# EAGLE board MOD-EEG-SMT (EAGLE 6.4)
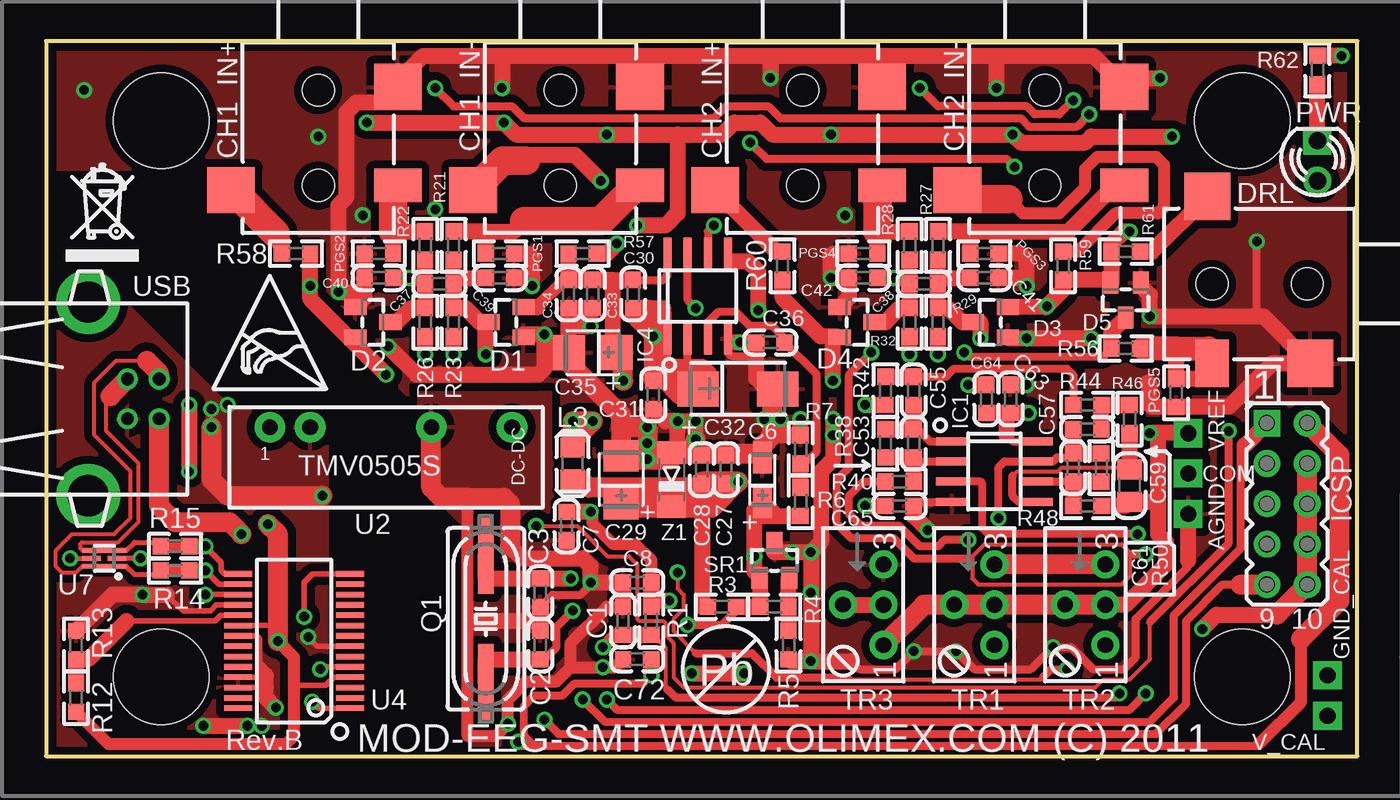
[diagram p1: board, top side]
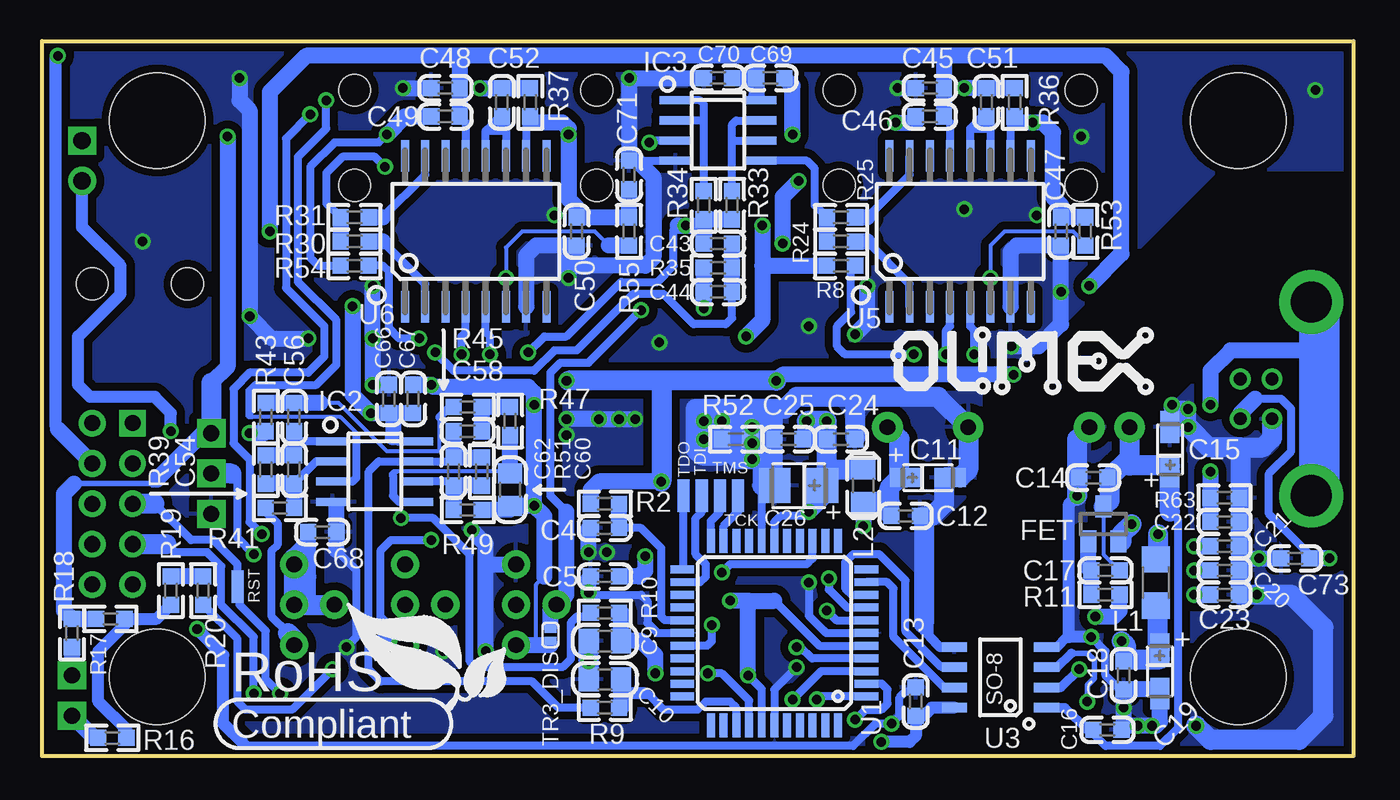
[diagram p2: board, bottom side, seen from below]

Size 82.5 x 45 mm. Coordinates in mm from the lower left corner, seen from the top.
Outline: 0,0 82.5,0 82.5,45 0,45 0,0
Copper layers (1+16): Top 0.035mm / dielectric 1.5mm / Bottom 0.035mm
Design rules "default": minimum track width 10mil, minimum drill 0.5994mm, track to track 10mil, track to pad 10mil, pad to pad 10mil, via to via 10mil, smd to smd 1mil, copper to edge 10mil, drill to drill 10mil, minimum pad ring 10mil, minimum via ring 8mil, stop-mask expansion 4mil, vias tented up to drill 25mil, thermal gap 20mil
Net classes: 1 pwr: width 0.4 mm, clearance 0.23 mm
Holes 6 mm at 7.25,5 75.25,5 7.25,40 75.25,40
tKeepout: area 22.5,43 to 30.5,45; area 21.2,0.2 to 29.2,2.2; area 45.9,0.1 to 61.9,2.1; area 45.3,43 to 61.3,45
bKeepout: area 46.8,43 to 62.8,45; area 22.5,43 to 30.5,45; area 21.2,0.2 to 29.2,2.2; area 47.3,0.2 to 63.3,2.2
tRestrict: 20 lines
bRestrict: 22 lines

## Footprints (pad centres in the part's own frame; a part is rotated, then mirrored left to right if it is on the bottom)
TEST_PAD40/70/SQUARE = drill 1.016 pad 1.778 square: P$1 0,0
C0603_DWS = smd 1.016 x 1.016: 1 -0.889,0; 2 0.889,0
CT3216 = smd 2 x 1.2: + -1.4,0; - 1.4,0
C0805_5MIL_DWS = smd 1.27 x 1.524: 1 -1.016,0; 2 1.016,0
C0603_DWS_NA = smd 1.016 x 1.016: 1 -0.889,0; 2 0.889,0
CT3528 = smd 2 x 2.2: + -1.5,0; - 1.5,0
CT6032 = smd 2.6 x 2.2: + -2.5,0; - 2.5,0
PHONE_JACK-SMD = smd 2.9 x 3: 1 -0.2,5; 5 6.3,-5.5 | smd 2.1 x 3: 2 6,5 | hole 2: 0,0; 6,0
SOT23C(BAT54S) = smd 1 x 1.4: 1 -0.95,-1.1; 2 0.95,-1.1; 3 0,1.1
SOT23 = smd 1 x 1.4: 1 -0.95,-1.1; 2 0.95,-1.1; 3 0,1.1
SO08 = smd 0.508 x 2.032: 1 -1.905,-2.667; 2 -0.635,-2.667; 3 0.635,-2.667; 4 1.905,-2.667; 5 1.905,2.667; 6 0.635,2.667; 7 -0.635,2.667; 8 -1.905,2.667
ML10_NEW = drill 1.016 pad 1.676 square: 1 -5.08,-1.27 | drill 1.016 pad 1.676: 2 -5.08,1.27; 3 -2.54,-1.27; 4 -2.54,1.27; 5 0,-1.27; 6 0,1.27; 7 2.54,-1.27; 8 2.54,1.27; 9 5.08,-1.27; 10 5.08,1.27
L1206_5MIL = smd 1.651 x 1.778: 1 -1.46,0; 2 1.46,0
L0805_5MIL_DWS = smd 1.27 x 1.524: 1 -1.016,0; 2 1.016,0
0603 = smd 1.016 x 1.016: 1 -0.889,0; 2 0.889,0
LED-3.0MM = drill 1.092 pad 1.778: A -1.27,0 | drill 1.092 pad 1.778 square: K 1.27,0
HC49/SMD2_THIN = smd 5 x 1: 1 -4.064,0; 2 4.064,0
R0603_5MIL_DWS = smd 1.016 x 1.016: 1 -0.889,0; 2 0.889,0
R0603_5MIL_DWS_NA = smd 1.016 x 1.016: 1 -0.889,0; 2 0.889,0
0603_0R = smd 1.016 x 1.016: 1 -0.889,0; 2 0.889,0
SMD80/30 = smd 2.032 x 0.762: P$1 0,0
SOT-23 = smd 1 x 1.4: 1 -0.95,-1.1; 2 0.95,-1.1; 3 0,1.1
S64Y = drill 0.991 pad 1.778: 1 2.54,1.27; 2 0,-1.27; 3 -2.54,1.27
SJ_1_SMALLER = smd 0.508 x 0.762: 1 -0.381,0; 2 0.381,0
44TQFP = smd 1.5 x 0.5: 1 -5.8,4; 2 -5.8,3.2; 3 -5.8,2.4; 4 -5.8,1.6; 5 -5.8,0.8; 6 -5.8,0; 7 -5.8,-0.8; 8 -5.8,-1.6; 9 -5.8,-2.4; 10 -5.8,-3.2; 11 -5.8,-4; 23 5.8,-4; 24 5.8,-3.2; 25 5.8,-2.4; 26 5.8,-1.6; 27 5.8,-0.8; 28 5.8,0; 29 5.8,0.8; 30 5.8,1.6; 31 5.8,2.4; 32 5.8,3.2; 33 5.8,4 | smd 0.5 x 1.5: 12 -4,-5.8; 13 -3.2,-5.8; 14 -2.4,-5.8; 15 -1.6,-5.8; 16 -0.8,-5.8; 17 0,-5.8; 18 0.8,-5.8; 19 1.6,-5.8; 20 2.4,-5.8; 21 3.2,-5.8; 22 4,-5.8; 34 4,5.8; 35 3.2,5.8; 36 2.4,5.8; 37 1.6,5.8; 38 0.8,5.8; 39 0,5.8; 40 -0.8,5.8; 41 -1.6,5.8; 42 -2.4,5.8; 43 -3.2,5.8; 44 -4,5.8
TMADCDC = drill 0.991 pad 1.93: 1 1.27,6.35; 2 1.27,3.81; 5 1.27,-3.81; 7 1.27,-8.89
SO-8_ISOLATE = smd 0.6 x 1.6: 1 -1.905,-2.9; 2 -0.635,-2.9; 3 0.635,-2.9; 4 1.905,-2.9; 5 1.905,2.9; 6 0.635,2.9; 7 -0.635,2.9; 8 -1.905,2.9
SSOP28 = smd 0.35 x 1.75: 1 -4.225,-3.525; 2 -3.575,-3.525; 3 -2.925,-3.525; 4 -2.275,-3.525; 5 -1.625,-3.525; 6 -0.975,-3.525; 7 -0.325,-3.525; 8 0.325,-3.525; 9 0.975,-3.525; 10 1.625,-3.525; 11 2.275,-3.525; 12 2.925,-3.525; 13 3.575,-3.525; 14 4.225,-3.525; 15 4.225,3.525; 16 3.575,3.525; 17 2.925,3.525; 18 2.275,3.525; 19 1.625,3.525; 20 0.975,3.525; 21 0.325,3.525; 22 -0.325,3.525; 23 -0.975,3.525; 24 -1.625,3.525; 25 -2.275,3.525; 26 -2.925,3.525; 27 -3.575,3.525; 28 -4.225,3.525
SO16 = smd 0.5 x 2: 1 -4.445,-4.75; 2 -3.175,-4.75; 3 -1.905,-4.75; 4 -0.635,-4.75; 5 0.635,-4.75; 6 1.905,-4.75; 7 3.175,-4.75; 8 4.445,-4.75; 9 4.445,4.75; 10 3.175,4.75; 11 1.905,4.75; 12 0.635,4.75; 13 -0.635,4.75; 14 -1.905,4.75; 15 -3.175,4.75; 16 -4.445,4.75
USBLC6-2P6 = smd 0.3 x 1.46: 1 -0.5,-0.65; 3 0.5,-0.65; 4 0.5,0.65; 6 -0.5,0.65 | smd 0.3 x 1.16: 2 0,-0.8; 5 0,0.8
USB_NEAR_BLACK = drill 0.8: 1 1.25,6.5; 2 -1.25,6.5; 3 -1.25,4.5; 4 1.25,4.5 | drill 2.6 pad 4: P$1 -6.096,2.032; P$2 6.096,2.032
MINI-MELF = smd 1.4 x 1.8: 1 -1.7,0; 2 1.7,0

## Placement (x,y rotation side)
AGND  TESTPAD3  [TEST_PAD40/70/SQUARE]  71.86,15.24 90 top
C1  100nF/X7R/10%  [C0603_DWS]  36.3,8.51 90 top
C2  39pF/COG/5%  [C0603_DWS]  31.09,6.99 90 top
C3  39pF/COG/5%  [C0603_DWS]  31.09,10.29 270 top
C4  10nF/X7R/10%  [C0603_DWS]  47.09,14.35 180 bottom
C5  100nF/X7R/10%  [C0603_DWS]  47.09,11.3 180 bottom
C6  10uF/6.3V/TANT  [CT3216]  45.06,17.4 90 top
C7  100nF/X7R/10%  [C0603_DWS]  32.74,14.48 270 top
C8  100nF/X7R/10%  [C0603_DWS]  37.19,10.92 180 top
C9  220nF/X7R/5%(08053C224JAT2A/1740667)  [C0805_5MIL_DWS]  47.09,7.24 180 bottom
C10  220nF/X7R/5%(08053C224JAT2A/1740667)  [C0805_5MIL_DWS]  47.09,4.83 180 bottom
C11  10uF/6.3V/TANT  [CT3216]  26.77,17.53 0 bottom
C12  100nF/X7R/10%  [C0603_DWS]  28.17,15.11 0 bottom
C13  100nF/X7R/10%  [C0603_DWS]  27.54,3.43 90 bottom
C14  100nF/X7R/10%  [C0603_DWS]  16.36,17.53 180 bottom
C15  10uF/6.3V/TANT  [CT3216]  11.53,19.3 90 bottom
C16  100nF/X7R/10%  [C0603_DWS]  15.47,1.65 0 bottom
C17  100nF/X7R/10%  [C0603_DWS]  15.6,11.68 180 bottom
C18  100nF/X7R/10%  [C0603_DWS]  14.45,5.08 270 bottom
C19  10uF/6.3V/TANT  [CT3216]  12.17,5.33 270 bottom
C20  NA  [C0603_DWS_NA]  8.1,11.68 0 bottom
C21  NA  [C0603_DWS_NA]  8.1,13.21 0 bottom
C22  10nF/X7R/10%  [C0603_DWS]  8.1,14.73 0 bottom
C23  100nF/X7R/10%  [C0603_DWS]  8.1,10.16 0 bottom
C24  10nF/X7R/10%  [C0603_DWS]  32.23,19.94 0 bottom
C25  100nF/X7R/10%  [C0603_DWS]  35.54,19.94 180 bottom
C26  47µF/6.3V/TANT  [CT3528]  34.9,17.02 180 bottom
C27  10nF/X7R/10%  [C0603_DWS]  42.77,18.03 90 top
C28  100nF/X7R/10%  [C0603_DWS]  41.25,18.03 90 top
C29  47µF/6.3V/TANT  [CT3528]  36.17,17.4 90 top
C30  100nF/X7R/10%  [C0603_DWS]  36.93,29.08 90 top
C31  100nF/X7R/10%  [C0603_DWS]  38.2,22.73 270 top
C32  47µF/10%/6.3V/TANT(C)/ESR 0.25 ohm (TR3C476K6R3C0250/1754044)  [CT6032]  43.54,23.11 0 top
C33  10nF/X7R/10%  [C0603_DWS]  34.39,29.08 270 top
C34  100nF/X7R/10%  [C0603_DWS]  32.87,29.08 270 top
C35  47µF/6.3V/TANT  [CT3528]  34.39,25.4 180 top
C36  10nF/X7R/10%  [C0603_DWS]  45.57,26.04 180 top
C37  10nF/X7R/10%  [C0603_DWS]  24.74,29.72 0 top
C38  10nF/X7R/10%  [C0603_DWS]  55.22,29.72 0 top
C39  100pF/COG/5%  [C0603_DWS]  28.55,30.1 180 top
C40  100pF/COG/5%  [C0603_DWS]  20.93,30.1 180 top
C41  100pF/COG/5%  [C0603_DWS]  59.03,30.1 180 top
C42  100pF/COG/5%  [C0603_DWS]  51.41,30.1 180 top
C43  1nF/X7R/10%  [C0603_DWS]  39.98,32.26 0 bottom
C44  1nF/X7R/10%  [C0603_DWS]  39.98,29.21 0 bottom
C45  100nF/X7R/10%  [C0603_DWS]  26.65,42.04 180 bottom
C46  100nF/X7R/10%  [C0603_DWS]  26.65,40.26 180 bottom
C47  100nF/X7R/10%  [C0603_DWS]  18.39,33.02 90 bottom
C48  100nF/X7R/10%  [C0603_DWS]  57.13,42.04 180 bottom
C49  100nF/X7R/10%  [C0603_DWS]  57.13,40.26 180 bottom
C50  100nF/X7R/10%  [C0603_DWS]  48.87,33.02 90 bottom
C51  1uF/X5R/10%  [C0603_DWS]  23.09,41.15 90 bottom
C52  1uF/X5R/10%  [C0603_DWS]  53.57,41.15 90 bottom
C53  1nF/X7R/10%  [C0603_DWS]  54.59,19.68 90 top
C54  1nF/X7R/10%  [C0603_DWS]  66.65,18.03 90 bottom
C55  1uF/X5R/10%  [C0603_DWS]  54.59,22.99 90 top
C56  1uF/X5R/10%  [C0603_DWS]  66.65,21.34 90 bottom
C57  33nF/X7R/5%(06035C333JAT2A/1740618)  [C0603_DWS]  65.51,20.57 180 top
C58  33nF/X7R/5%(06035C333JAT2A/1740618)  [C0603_DWS]  55.73,20.45 180 bottom
C59  220nF/X7R/5%(08053C224JAT2A/1740667)  [C0805_5MIL_DWS]  68.17,17.02 270 top
C60  220nF/X7R/5%(08053C224JAT2A/1740667)  [C0805_5MIL_DWS]  53.06,16.76 270 bottom
C61  1nF/X7R/10%  [C0603_DWS]  64.62,18.16 90 top
C62  1nF/X7R/10%  [C0603_DWS]  56.62,17.91 90 bottom
C63  100nF/X7R/10%  [C0603_DWS]  60.68,22.48 90 top
C64  100nF/X7R/10%  [C0603_DWS]  59.16,22.48 90 top
C65  100nF/X7R/10%  [C0603_DWS]  53.7,15.75 180 top
C66  100nF/X7R/10%  [C0603_DWS]  60.68,22.48 90 bottom
C67  100nF/X7R/10%  [C0603_DWS]  59.16,22.48 90 bottom
C68  100nF/X7R/10%  [C0603_DWS]  64.87,14.1 180 bottom
C69  100nF/X7R/10%  [C0603_DWS]  36.68,42.67 0 bottom
C70  100nF/X7R/10%  [C0603_DWS]  39.98,42.67 180 bottom
C71  100nF/X7R/10%  [C0603_DWS]  45.57,36.58 270 bottom
C72  100nF/X7R/10%  [C0603_DWS]  37.19,6.1 180 top
C73  100nF/X7R/10%  [C0603_DWS]  3.66,12.45 180 bottom
CH1_IN+  SCJ325P00XG0B02G  [PHONE_JACK-SMD]  17.12,41.91 270 top
CH1_IN-  SCJ325P00XG0B02G  [PHONE_JACK-SMD]  32.36,41.91 270 top
CH2_IN+  SCJ325P00XG0B02G  [PHONE_JACK-SMD]  47.6,41.91 270 top
CH2_IN-  SCJ325P00XG0B02G  [PHONE_JACK-SMD]  62.84,41.91 270 top
COM  TESTPAD3  [TEST_PAD40/70/SQUARE]  71.86,17.78 90 top
D1  BAV199(1156415)  [SOT23C(BAT54S)]  28.93,27.3 90 top
D2  BAV199(1156415)  [SOT23C(BAT54S)]  20.55,27.3 270 top
D3  BAV199(1156415)  [SOT23C(BAT54S)]  59.41,27.3 90 top
D4  BAV199(1156415)  [SOT23C(BAT54S)]  51.03,27.3 270 top
D5  BAV199(1156415)  [SOT23C(BAT54S)]  67.92,28.7 180 top
DRL  SCJ325P00XG0B02G  [PHONE_JACK-SMD]  79.35,29.72 180 top
FET  IRLML6402  [SOT23]  15.72,14.61 0 bottom
GND_CAL  TESTPAD3  [TEST_PAD40/70/SQUARE]  80.62,5.08 180 top
IC1  MCP607-I/SN  [SO08]  59.67,17.91 270 top
IC2  MCP607-I/SN  [SO08]  61.57,17.91 270 bottom
IC3  MCP607-I/SN  [SO08]  39.98,39.37 270 bottom
IC4  TLC277CD  [SO08]  41,28.96 0 top
ICSP  HN2x5  [ML10_NEW]  78.08,15.88 270 top
L1  FB/600 OHM/1206(321611C-601)  [L1206_5MIL]  12.42,10.92 270 bottom
L2  22µH/± 10%/1.7ohm/80mA(LB2012T220K/8030984)  [L0805_5MIL_DWS]  30.84,17.02 90 bottom
L3  22µH/± 10%/1.7ohm/80mA(LB2012T220K/8030984)  [L0805_5MIL_DWS]  33.12,18.41 270 top
PGS1  PGB1010603MR(F2594TR-ND)  [0603]  28.55,31.62 180 top
PGS2  PGB1010603MR(F2594TR-ND)  [0603]  20.93,31.62 180 top
PGS3  PGB1010603MR(F2594TR-ND)  [0603]  59.03,31.62 180 top
PGS4  PGB1010603MR(F2594TR-ND)  [0603]  51.41,31.62 180 top
PGS5  PGB1010603MR(F2594TR-ND)  [0603]  71.1,22.86 90 top
PWR  3mm_Red  [LED-3.0MM]  79.99,37.47 90 top
Q1  7.3728MHz/20pF/30ppm  [HC49/SMD2_THIN]  27.66,8.64 90 top
R1  10k  [R0603_5MIL_DWS]  38.08,8.51 270 top
R2  100R  [R0603_5MIL_DWS]  47.09,15.88 180 bottom
R3  560R  [R0603_5MIL_DWS]  42.52,9.4 180 top
R4  9.1k/1%  [R0603_5MIL_DWS]  45.82,9.4 180 top
R5  15k/1%  [R0603_5MIL_DWS]  46.71,6.99 90 top
R6  10k/1%  [R0603_5MIL_DWS]  47.47,16 270 top
R7  10k/1%  [R0603_5MIL_DWS]  47.47,19.3 270 top
R8  NA(10M)  [R0603_5MIL_DWS]  32.23,30.86 0 bottom
R9  7.5k/1%  [R0603_5MIL_DWS]  47.09,3.05 180 bottom
R10  7.5k/1%  [R0603_5MIL_DWS]  47.09,9.02 180 bottom
R11  1k  [R0603_5MIL_DWS]  15.6,10.16 180 bottom
R12  10k  [R0603_5MIL_DWS]  1.88,3.68 270 top
R13  NA  [R0603_5MIL_DWS_NA]  1.88,6.99 270 top
R14  0R(NA)  [0603_0R]  8.1,11.68 0 top
R15  0R(NA)  [0603_0R]  8.1,13.21 0 top
R16  10k/1%  [R0603_5MIL_DWS]  78.08,1.14 0 bottom
R17  100R/1%  [R0603_5MIL_DWS]  78.21,8.64 0 bottom
R18  10k/1%  [R0603_5MIL_DWS]  80.62,7.75 90 bottom
R19  1M/1%  [R0603_5MIL_DWS]  74.4,10.41 90 bottom
R20  1M/1%  [R0603_5MIL_DWS]  72.37,10.41 270 bottom
R21  2.2k/1%  [R0603_5MIL_DWS]  25.63,32.13 270 top
R22  2.2k/1%  [R0603_5MIL_DWS]  23.85,32.13 270 top
R23  2.2k/1%  [R0603_5MIL_DWS]  25.63,27.3 90 top
R24  2.2k/1%  [R0603_5MIL_DWS]  32.23,32.38 180 bottom
R25  2.2k/1%  [R0603_5MIL_DWS]  32.23,33.91 180 bottom
R26  2.2k/1%  [R0603_5MIL_DWS]  23.85,27.3 90 top
R27  2.2k/1%  [R0603_5MIL_DWS]  56.11,32.13 270 top
R28  2.2k/1%  [R0603_5MIL_DWS]  54.33,32.13 270 top
R29  2.2k/1%  [R0603_5MIL_DWS]  56.11,27.3 90 top
R30  2.2k/1%  [R0603_5MIL_DWS]  62.84,32.38 180 bottom
R31  2.2k/1%  [R0603_5MIL_DWS]  62.84,33.91 180 bottom
R32  2.2k/1%  [R0603_5MIL_DWS]  54.33,27.3 90 top
R33  10k/1%  [R0603_5MIL_DWS]  39.09,34.67 90 bottom
R34  10k/1%  [R0603_5MIL_DWS]  40.87,34.67 90 bottom
R35  200k/1%  [R0603_5MIL_DWS]  39.98,30.73 180 bottom
R36  1M/1%  [R0603_5MIL_DWS]  21.31,41.15 270 bottom
R37  1M/1%  [R0603_5MIL_DWS]  51.79,41.15 270 bottom
R38  100k/1%  [R0603_5MIL_DWS]  52.81,19.68 90 top
R39  100k/1%  [R0603_5MIL_DWS]  68.43,18.03 90 bottom
R40  1k  [R0603_5MIL_DWS]  53.7,17.27 180 top
R41  1k  [R0603_5MIL_DWS]  67.54,15.62 180 bottom
R42  1M/1%  [R0603_5MIL_DWS]  52.81,22.99 270 top
R43  1M/1%  [R0603_5MIL_DWS]  68.43,21.34 270 bottom
R44  10k/1%  [R0603_5MIL_DWS]  65.51,22.1 0 top
R45  10k/1%  [R0603_5MIL_DWS]  55.73,21.97 0 bottom
R46  15k/1%  [R0603_5MIL_DWS]  68.17,21.21 270 top
R47  15k/1%  [R0603_5MIL_DWS]  53.06,21.08 270 bottom
R48  8.2k/1%  [R0603_5MIL_DWS]  65.51,15.75 0 top
R49  8.2k/1%  [R0603_5MIL_DWS]  55.73,15.49 0 bottom
R50  100k/1%  [R0603_5MIL_DWS]  66.4,18.16 90 top
R51  100k/1%  [R0603_5MIL_DWS]  54.84,17.91 90 bottom
R52  0R(NA)  [0603_0R]  38.84,19.94 0 bottom
R53  NA(10M)  [R0603_5MIL_DWS]  16.87,33.02 270 bottom
R54  NA(10M)  [R0603_5MIL_DWS]  62.84,30.86 0 bottom
R55  NA(10M)  [R0603_5MIL_DWS]  45.57,33.02 270 bottom
R56  2.2k/1%  [R0603_5MIL_DWS]  67.92,25.65 180 top
R57  100R  [R0603_5MIL_DWS]  33.76,31.62 180 top
R58  100R  [R0603_5MIL_DWS]  15.72,31.62 0 top
R59  100R  [R0603_5MIL_DWS]  63.98,30.86 270 top
R60  100R  [R0603_5MIL_DWS]  46.33,30.86 270 top
R61  NA  [R0603_5MIL_DWS_NA]  67.92,31.75 180 top
R62  560R  [R0603_5MIL_DWS]  79.99,43.18 270 top
R63  1M  [R0603_5MIL_DWS]  8.1,16.26 180 bottom
RST  TESTPAD80/30  [SMD80/30]  70.21,10.67 90 bottom
SR1  AP431SA  [SOT-23]  45.82,12.32 0 top
TCK  TESTPAD80/30  [SMD80/30]  38.71,16.38 90 bottom
TDI  TESTPAD80/30  [SMD80/30]  41,16.38 90 bottom
TDO  TESTPAD80/30  [SMD80/30]  42.14,16.38 90 bottom
TMS  TESTPAD80/30  [SMD80/30]  39.85,16.38 270 bottom
TR1  20k  [S64Y]  58.4,9.53 270 top
TR2  20k  [S64Y]  65.38,9.53 270 top
TR3  NA(20k)???  [S64Y]  51.41,9.53 270 top
TR3_DIS  Close  [SJ_1_SMALLER]  50.52,7.62 270 bottom
U1  ATMEGA16  [44TQFP]  36.42,7.75 180 bottom
U2  TMV0505S  [TMADCDC]  20.42,19.43 90 top
U3  ISO7221XD(SOIC8)  [SO-8_ISOLATE]  22.2,4.95 90 bottom
U4  FT232RL/SSOP28  [SSOP28]  15.6,7.24 90 top
U5  INA114BU/1K  [SO16]  24.74,33.02 0 bottom
U6  INA114BU/1K  [SO16]  55.22,33.02 0 bottom
U7  NA(USBLC6-2P6)  [USBLC6-2P6]  3.66,12.45 90 top
U$1  [ESD_SYMBOL]  10.52,23.11 0 top
U$2  [OLIMEX1_V]  11.41,22.61 0 bottom
U$3  [PB]  42.77,5.46 0 top
U$4  [RECYCLE_BIN1/8]  1.25,31.11 0 top
U$11  [ROHS]  70.59,1.14 0 bottom
USB  USB_B  [USB_NEAR_BLACK]  0.61,22.48 270 top
V_CAL  TESTPAD3  [TEST_PAD40/70/SQUARE]  80.62,2.54 180 top
VREF  TESTPAD3  [TEST_PAD40/70/SQUARE]  71.86,20.32 0 top
Z1  BZV55C6V2  [MINI-MELF]  39.35,17.4 90 top

## Tracks (layer width: path | path; a pad name or v marks a point on that pad's centre or on a via)
2V_REF
  Top 0.508: IC4.3 41.63,27.3 42.27,27.94 43.41,27.94 44.3,27.05 45.7,27.05 46.46,26.29 C36.1 48.49,24 48.49,19.18 47.73,18.41 R7.2
  Top 1.016: R6.1 R7.2
4V_REF_ADC  (via drill 0.6)
  Top 0.508: v40.36,8.26 42.52,8.26 43.41,9.14 R3.1
  Top 1.016: R3.1 R4.2 44.93,11.22 SR1.1 44.87,11.3 44.55,11.62 v44.55,12.57 44.55,15.11 | 44.55,15.11 44.55,15.49 C6.+ 45.95,15.11 | 45.95,15.11 R6.2 | 44.55,15.11 45.95,15.11
  Bottom 0.508: C5.1 46.2,11.05 | U1.29 40.65,6.95 40.36,7.24 v40.36,8.26
  Bottom 0.813: 46.08,11.3 C5.1
  Bottom 1.016: v44.55,12.57 44.55,11.68 44.93,11.3 46.08,11.3
+5V  (via drill 0.6)
  Top 0.508: IC4.8 39.09,30.23 38.84,29.97 C30.2 | IC1.8 60.81,19.81 60.43,20.19 | C27.1 43.41,17.14 v43.54,17.27
  Top 0.762: C34.1 32.62,29.97 30.9,28.25
  Top 1.016: 41.25,17.02 C28.1 | R3.2 41.25,9.4 41.25,15.62 | C35.+ 35.66,25.4 35.66,29.97 | 35.66,29.97 C33.1 C34.1 R57.2 | 35.66,29.97 C30.2 | 30.9,28.25 D1.2 | 19.45,25.94 16.61,28.78 v16.61,29.59 R58.2 | D2.2 19.45,25.94 | 19.45,25.94 v21.39,24 | D3.2 62.9,28.25 v62.97,28.32 63.98,29.34 R59.2 66.97,29.97 D5.2 67.03,29.8 R61.2 67.03,32.26 67.79,33.02 v68.17,33.02 | 49.51,26.42 49.7,26.42 49.76,26.36 D4.2 | v49.51,23.62 49.51,26.42 | 49.51,26.42 48.74,26.42 46.33,28.83 R60.2 | C66.1 C67.1 | C66.1 60.43,21.59 60.43,20.19 | v61.82,21.59 C66.1
  Top 1.27: L3.2 33.63,17.4 34.14,16.89 36.17,16.89 | 36.17,16.89 36.17,16.26 | 41.25,16.89 36.17,16.89 | 36.17,16.26 C29.+ | 39.35,16.26 39.35,15.62 | 39.35,15.62 Z1.1 | 39.35,16.26 36.17,16.26 | 41.89,17.27 v43.54,17.27 41.89,15.62 | 41.89,17.27 41.25,17.27 41.25,17.02 41.25,16.89 | 41.25,16.26 39.35,16.26 | 41.25,16.89 41.25,16.26 | 41.89,15.62 41.25,15.62 | 41.25,15.62 41.25,16.26 | v36.3,23.62 36.3,25.4 C35.+ | 41.25,15.62 39.85,15.62 | 41.89,17.27 41.89,15.62 | 39.35,15.62 36.17,15.62
  Bottom 0.508: C46.1 25.38,39.88 U5.13 | 55.86,37.72 U6.13 55.86,39.88 C49.1 | IC3.8 37.57,41.27 37.57,41.53 | 60.43,20.07 60.17,19.81 IC2.8
  Bottom 1.016: R2.2 47.98,16.76 47.47,17.27 v43.54,17.27 | v36.3,23.62 35.92,24 v21.39,24 | v16.61,29.59 14.58,31.62 14.58,43.05 15.6,44.07 25.76,44.07 | 25.76,44.07 C45.1 C46.1 | C49.1 C48.1 56.24,44.07 | C69.1 37.57,41.53 | C69.1 C70.1 | 25.76,44.07 37.57,44.07 | 37.57,44.07 C69.1 | 37.57,44.07 56.24,44.07 | 56.24,44.07 65.89,44.07 68.17,41.78 v68.17,33.02 | 49.38,23.62 v49.51,23.62 | 60.43,21.59 C66.1 v61.82,21.59 62.97,22.73 v62.97,28.32 | 60.43,21.59 60.43,20.07 | 60.43,21.59 C67.1
  Bottom 1.27: 43.54,23.62 v43.54,17.27 | v36.3,23.62 43.54,23.62 | 43.54,23.62 49.38,23.62
+5V_USB
  Bottom 0.254: FET.3 15.72,12.7 C17.1
  Bottom 0.508: 11.53,15.37 11.03,14.86 11.03,1.78 12.17,0.64 15.6,0.64 16.36,1.4 C16.1
  Bottom 0.61: U3.1 18.14,3.05 16.74,1.65 C16.1
  Bottom 1.016: 15.34,17.53 C14.1
  Bottom 1.27: FET.3 15.34,16.09 15.34,17.53 14.07,18.8 | 14.07,18.8 U2.1 | 14.07,18.8 14.07,18.29 11.53,18.29 C15.+ 11.53,15.37
+12V  (via drill 0.6)
  Top 0.254: v30.84,14.48 33.43,14.48 35.33,12.57 36.68,12.57 37.19,12.06 37.19,8.64 37.31,8.51 38.84,8.51 38.96,8.38 38.96,7.62 39.47,7.11 39.47,4.95 40.11,4.32 66.02,4.32 66.52,4.83 68.17,4.83 69.44,6.1 69.44,8.43
  Top 0.508: v74.4,20.45 74.4,13.39 69.44,8.43
  Bottom 0.762: PWR.A 79.99,33.27 77.57,30.86 77.57,29.08 80.24,26.42 80.24,23.37 79.48,22.61 75.41,22.61 74.4,21.59 v74.4,20.45
  Bottom 1.016: C12.1 29.19,15.11 29.19,15.24 | L2.1 v30.84,14.48
  Bottom 1.27: U2.7 28.55,19.94 28.55,17.53 | 29.19,15.24 29.19,16 | 29.19,16 29.19,16.89 28.55,17.53 | 28.55,17.53 C11.+ | 29.19,16 L2.1
ADC0  (via drill 0.6)
  Top 1.016: v40.62,5.21 v43.92,5.21
  Bottom 0.508: C9.1 46.08,7.02 | U1.37 38.02,3.5 39.73,5.21 v40.62,5.21
  Bottom 1.016: R10.1 46.08,9.02 C9.1 44.81,7.24 43.92,6.35 v43.92,5.21
ADC1
  Bottom 0.508: 44.3,3.81 43.41,2.92 41.25,2.92 40.74,3.43 39.22,3.43 38.82,3.04 U1.36 | 44.3,3.81 44.55,4.06 46.08,4.06 | 44.3,3.81 46.08,3.81
  Bottom 1.016: R9.1 46.08,3.05 46.08,3.81 46.08,4.06 C10.1
CH1_IN+
  Top 1.016: R22.1 21.82,33.02 PGS2.1
  Top 1.778: 21.82,33.02 21.82,35.91 CH1_IN+.2
CH1_IN-
  Top 1.016: 27.66,33.02 R21.1 | 27.66,33.02 29.44,33.02 30.07,33.66 | PGS1.2 27.66,33.02
  Top 1.778: 30.07,33.66 34.9,33.66 37.16,35.91 CH1_IN-.2
CH2_IN+
  Top 1.016: R28.1 52.3,33.02 PGS4.1
  Top 1.778: 52.3,33.02 52.3,35.91 CH2_IN+.2
CH2_IN-
  Top 1.016: CH2_IN-.2 67.84,35.43 66.73,35.43 64.32,33.02 58.14,33.02 | 58.14,33.02 R27.1 | PGS3.2 58.14,33.02
DRL
  Top 1.016: DRL.2 73.35,25.65 73.13,25.65 | 69.06,25.65 R56.1 | 71.1,25.65 PGS5.2 73.25,23.75
  Top 1.524: 69.06,25.65 71.1,25.65 73.13,25.65
GND  (via drill 0.6)
  Top 0.305: 4.42,12.45 U7.2 v5.95,12.45
  Top 0.356: U4.18 10.71,9.51 10.34,9.14 8.61,9.14 7.6,10.16 | U4.7 17.06,6.91 v16.49,7.49 | U4.21 13.24,7.56 13.44,7.37 13.44,5.92 | 13.44,5.08 13.82,5.08 13.82,5.33 13.44,5.71 | 13.44,5.08 13.44,4.96 U4.25 | 13.44,5.08 13.44,5.71 | 13.44,5.71 13.44,5.92 | 13.82,4.31 U4.26 | 13.44,5.92 14.07,5.28
  Top 1.016: 7.6,10.16 v6.07,10.16 4.17,10.16 R13.1 | 13.82,5.08 13.82,4.31 13.82,3.68 v14.45,3.05 | v9.88,1.91 v12.68,1.91
  Top 1.27: v17.38,16.38 11.41,16.38 10.39,17.4 v10.39,20.7
  Bottom 0.508: C18.2 14.45,4.45 14.96,4.45 15.6,5.08 15.6,6.6 v16.49,7.49
  Bottom 0.61: 17.91,7.49 18.01,7.49 18.64,6.86 U3.4
  Bottom 0.762: 17.88,7.49 17.91,7.49 | 17.88,7.49 17.88,15.88 v17.38,16.38 | v16.49,7.49 17.88,7.49
  Bottom 1.016: C73.2 v5.95,12.45 7.09,12.45 7.09,13.21 C21.2 | 7.09,14.73 C22.2 | 7.09,10.16 C23.2 | 7.09,11.68 C20.2 | 7.09,16.26 R63.1 | 17.38,17.53 C14.2 | 11.41,20.7 11.41,20.83 10.39,20.83 v10.39,21.84 11.41,21.84 v11.41,22.1 | 14.45,1.91 v14.45,3.05 C18.2 12.17,4.19 C19.- 12.17,2.16 12.42,1.91 v12.68,1.91 v13.57,1.91 14.45,1.91 | 14.45,1.91 14.45,1.65 C16.2
  Bottom 1.27: 7.09,12.45 7.09,11.68 7.09,10.16 v6.07,10.16 3.91,10.16 1.88,8.13 1.88,2.54 3.4,1.02 8.99,1.02 v9.88,1.91 | 7.09,13.21 7.09,14.73 7.09,16.26 7.09,19.43 | USB.4 5.11,20.01 5.69,19.43 7.09,19.43 | U2.2 17.38,19.94 17.38,17.53 v17.38,16.38 | C15.- 11.41,20.7 v10.39,20.7 9.12,19.43 7.09,19.43
  pour Top (isolate 0.508, rank 3): -4.47,-1.91 -4.47,30.73 3.79,30.73 12.04,22.48 16.61,22.48 18.39,20.7 18.39,-1.91
  pour Bottom (isolate 0.508, rank 3): -4.47,-4.45 -4.47,30.73 3.79,30.73 12.04,22.48 16.61,22.48 18.39,20.7 18.39,-4.45
GNDA  (via drill 0.6)
  Top 0.508: 42.9,26.04 42.9,25.4 43.16,25.15 44.68,25.15 | 42.9,26.04 IC4.4 | IC1.4 54.84,16 C65.1 | 50.65,5.97 51.16,5.46 53.44,5.46 v54.59,6.6 v57.25,6.6 58.4,5.46 61.95,5.46 v63.35,6.86 64.49,6.86 65.89,5.46 67.79,5.46 68.56,6.22 68.56,8.64 71.86,11.94 71.86,12.29 | 76.18,27.69 v76.18,32.38 | 43.16,26.04 42.9,26.04
  Top 1.016: 41.25,19.05 C28.2 | 42.77,19.05 C27.2 | 39.73,19.05 v39.73,21.08 | v40.87,19.94 v40.87,21.08 v39.73,21.08 | SR1.3 45.82,12.83 v46.97,12.83 v48.11,12.83 | v48.11,5.97 46.84,5.97 R5.1 | 32.87,25.4 C35.- | 32.87,25.4 32.87,25.91 | 32.87,25.91 32.87,27.05 | 32.87,27.05 C34.2 C33.2 34.27,28.19 v34.27,27.05 32.87,27.05 | 30.58,30.1 C39.1 | D1.1 30.03,26.54 v31.34,26.54 31.34,25.91 | 32.87,25.4 32.87,24.77 31.34,24.77 | 31.34,24.77 31.34,24.38 30.96,24 23.29,24 v21.52,25.78 | 31.34,24.77 31.34,25.4 | 31.34,25.4 31.34,25.91 | CH1_IN+.1 22.12,42.08 21.18,41.15 19.53,41.15 18.9,40.51 18.9,35.18 18.39,34.67 v18.39,29.21 19.35,29.21 19.35,28.25 D2.1 20.04,28.85 C40.2 PGS2.2 | CH1_IN+.1 22.12,42.04 | CH1_IN+.1 22.12,42.47 23.72,44.07 28.68,44.07 | 61.7,30.1 C41.1 | D3.1 60.58,26.29 v61.7,26.29 v65.76,26.29 | 52.6,42.04 CH2_IN+.1 52.6,44.07 | 28.68,44.07 v28.68,42.04 | 28.68,44.07 37.36,44.07 | 45.57,44.07 52.6,44.07 | 59.79,44.07 65.88,44.07 CH2_IN-.1 67.84,42.67 v70.08,42.67 | 37.36,44.07 CH1_IN-.1 | 37.36,44.07 45.57,44.07 | 59.79,44.07 v59.79,42.04 | 52.6,44.07 59.79,44.07 | D5.1 68.87,29.59 69.44,29.02 v69.44,27.69 76.18,27.69 76.58,27.69 DRL.1 77.14,24.72 74.4,21.97 PGS5.1 69.57,21.97 69.44,22.1 69.44,23.37 69.32,23.5 | 46.2,20.19 R7.1 v47.47,21.21 | 49.93,28.32 D4.1 50.52,28.85 C42.2 v49.38,30.1 49.38,31.5 49.51,31.62 PGS4.2 | 45.57,44.07 v45.57,42.67 | 45.7,23.11 45.31,23.11 44.68,23.75 44.68,25.15 C36.2 v43.66,26.04 43.16,26.04 | C31.2 38.96,21.08 v39.73,21.08 | v48.11,5.97 v48.11,10.29 v48.11,12.83 | v61.7,23.37 C66.2 | v48.11,5.97 50.65,5.97 | 71.86,12.29 AGND.P$1 | v55.48,14.22 54.59,15.11 C65.1 | PGS1.1 30.33,31.62 30.58,31.37 30.58,30.1
  Top 1.016: v30.58,29.59 30.58,30.1 | PGS3.1 61.32,31.62 61.7,31.24 61.7,30.1 | v61.7,29.59 61.7,30.1 | v48.11,12.83 48.74,13.46 48.74,17.91 49.51,18.67 v49.51,20.19 v49.51,21.21 | 45.7,20.19 46.2,20.19 | 46.2,20.19 v46.2,21.21 | 31.34,25.91 32.87,25.91 | 31.34,25.4 32.87,25.4
  Top 1.27: 39.35,19.05 39.35,18.67 v37.82,18.67 | 39.35,19.05 Z1.2 | 39.35,19.05 39.73,19.05 40.87,19.05 | 40.87,19.05 41.25,19.05 42.77,19.05 45.06,19.05 | 40.87,19.05 v40.87,19.94 | 45.06,19.05 C6.- | 36.17,20.7 36.17,21.46 32.89,24.74 C35.- | 36.17,20.7 C29.- 36.17,18.67 v37.82,18.67 | 45.06,19.05 45.06,19.56 45.7,20.19 45.7,23.11 C32.- | 36.17,20.7 v37.82,20.7 v37.82,19.68 v37.82,18.67
  Bottom 0.508: 47.98,11.18 C5.2 | C71.1 IC3.4 | IC2.4 63.98,16 63.98,15.75 | v63.35,6.86 62.71,7.49 62.71,11.68 63.98,12.95 | U1.28 43.79,7.75 44.43,8.38 44.43,9.78 44.81,10.16 48.11,10.16 v48.11,10.29
  Bottom 1.016: v31.34,26.54 30.58,27.3 v30.58,29.59 | v21.52,25.78 19.79,25.78 18.39,27.18 v18.39,29.21 C47.1 21.18,32.13 21.57,31.75 U5.7 | v28.68,42.04 C45.2 | v61.7,29.59 v61.7,26.29 v61.7,23.37 C66.2 | v59.79,42.04 C48.2 | U6.7 52.05,31.5 51.41,32.13 49.38,32.13 | 49.38,32.13 C50.1 48.87,30.86 44.55,30.86 44.05,31.37 44.05,36.45 45.06,37.47 C71.1 v45.57,42.67 C70.2 | 49.38,32.13 v49.38,30.1 | v70.08,42.67 70.08,41.27 69.44,40.64 v69.44,27.69 68.05,26.29 v65.76,26.29 | 63.98,15.75 C68.1 63.98,12.95 | 54.59,12.06 54.59,13.34 v55.48,14.22 | v45.19,21.21 v47.47,21.21 v49.51,21.21 | 54.59,12.06 TR3.3 | v54.59,6.6 54.59,12.06 | 47.98,11.18 48.11,11.18 v48.11,10.29 | C4.2 48.11,14.35 v48.11,12.83
  Bottom 1.27: C10.2 v48.11,5.97 C9.2 | v39.73,21.08 R52.1 v40.87,19.94 v40.87,21.08 v39.73,21.08
  other vias: 2.39,41.91 17.12,38.99 50.27,34.04 24.49,34.42 19.91,34.04
  pour Top (isolate 0.508, rank 2): -2.56,36.2 8.23,36.2 23.47,20.95 23.47,16.51 26.01,13.97 26.01,-5.08 88.24,-5.08 88.24,46.99 -2.56,46.99
  pour Bottom (isolate 0.508, rank 2): -2.56,36.2 8.23,36.2 23.47,20.95 23.47,16.51 26.01,13.97 26.01,-5.08 85.7,-5.08 85.7,46.99 -2.56,46.99
MISO  (via drill 0.6)
  Top 0.508: 75.16,10.79 74.02,10.79 71.73,8.51 71.73,3.3 69.83,1.4 32.23,1.4 v31.34,2.29
  Top 1.27: 75.16,10.79 ICSP.9
  Bottom 0.508: v31.34,2.29 30.71,2.92 29.69,2.92 29.31,3.3 29.31,4.19 29.67,4.55 U1.2
MOSI  (via drill 0.6)
  Top 0.508: 75.41,19.56 75.16,19.3 75.16,13.06 70.97,8.87 70.97,3.68 69.44,2.16 35.16,2.16 v33.76,3.56
  Top 1.016: 75.41,19.56 ICSP.1
  Bottom 0.508: v33.76,3.56 33.57,3.75 U1.1
N$1
  Top 0.305: U7.1 5.05,11.95 5.56,11.43 7.21,11.43 R14.1
N$2
  Top 0.305: U7.3 5.05,12.95 5.56,13.46 7.21,13.46 R15.1
N$3
  Bottom 0.508: U1.24 41.1,10.95 40.74,11.3 40.74,12.06 41.38,12.7 41.38,14.99 41,15.37 TDI.P$1
N$4
  Bottom 0.508: U1.23 42.14,11.75 TDO.P$1
N$5
  Bottom 0.508: U1.22 40.42,14.8 39.85,15.37 TMS.P$1
N$6
  Bottom 0.508: U1.21 39.62,14.48 38.71,15.39 TCK.P$1
N$7  (via drill 0.6)
  Top 1.016: 30.2,37.47 30.58,37.85 33.25,37.85 v34.9,36.2 | v35.92,32.26 35.28,31.62 R57.1
  Top 1.778: CH1_IN-.5 28.72,37.47 30.2,37.47
  Bottom 1.016: v34.9,36.2 35.92,35.18 v35.92,32.26
N$8
  Top 1.016: R58.1 14.84,32.51 14.45,32.89
  Top 1.778: CH1_IN+.5 11.74,35.61 14.45,32.89
N$9  (via drill 0.6)
  Top 0.508: v57.76,25.4 58.02,25.15 66.52,25.15 R56.2
  Top 1.016: D5.3 67.03,26.71 R56.2
  Bottom 0.508: C44.2 39.09,27.56 39.47,27.18 41.51,27.18 43.41,29.08 45.31,29.08 48.87,25.53 50.27,25.53 51.54,24.26 56.62,24.26 v57.76,25.4
  Bottom 1.016: C43.2 R35.1 C44.2
N$10
  Top 1.016: CH2_IN+.5 43.04,34.67 43.03,34.67 45.95,31.75 R60.1
N$11
  Top 0.762: 60.55,35.05 61.44,34.16 63.73,34.16 65.38,35.81 65.38,36.96 66.14,37.72 69.83,37.72 70.33,37.21 70.33,34.54 69.95,34.16 67.29,34.16 64.87,31.75 R59.1
  Top 1.778: CH2_IN-.5 57.34,35.05 60.55,35.05
N$12
  Top 1.016: DRL.5 69.58,31.75 R61.1
N$15
  Top 1.016: PWR.K R62.2
N$16  (via drill 0.6)
  Top 0.356: v17.25,5.46 17.4,5.61 U4.5
  Bottom 0.61: U3.2 18.39,4.32 v17.25,5.46
N$17  (via drill 0.6)
  Top 1.016: v8.99,22.1 v8.99,17.91
  Bottom 1.016: C22.1 R63.2 v8.99,17.91 | v8.99,22.1 8.99,24.26 7.72,25.53 2.13,25.53
  Bottom 2.54: USB.P$2 2.13,16.89 2.13,25.53 2.13,28.07 USB.P$1
N$18
  Top 0.254: U7.6 2.27,11.95 1.88,11.56 0.99,11.56 0.61,11.94 0.61,12.95 1.63,13.97 4.29,13.97 5.31,14.99 5.31,17.91 3.02,20.19 3.02,23.5 4.42,24.89 6.33,24.89
  Top 1.27: 6.33,24.89 7.11,24.11 USB.2
N$20  (via drill 0.6)
  Top 0.356: U4.1 17.15,3.01 v16.74,3.43
  Bottom 0.356: v16.74,3.43 16.74,4.45 16.28,4.9 16.28,6.02 16.74,6.48 17.76,6.48
  Bottom 0.61: U3.3 18.64,5.59 17.76,6.48
N$21
  Bottom 0.508: U1.27 43.32,8.55 43.54,8.76 43.54,13.08 44.81,14.35 C4.1
  Bottom 1.016: C4.1 R2.1
N$22
  Top 1.016: SR1.2 46.71,11.22 R4.1 R5.2
N$23
  Bottom 0.508: U1.10 29.34,10.95 28.93,10.54 28.93,7.49 25.76,4.32 U3.7
N$24
  Bottom 0.508: U1.9 31.56,10.15 31.98,10.57 31.98,12.19 31.47,12.7 29.82,12.7 28.17,11.05 28.17,7.85 25.91,5.59 U3.6
N$25
  Top 0.254: U7.4 2.27,12.95 2.13,13.08 2.13,13.34 2.26,13.46 4.55,13.46 5.82,14.73 5.82,18.41 3.79,20.45 3.79,22.4 4.04,22.66
  Top 1.27: 4.04,22.66 USB.3
N$26  (via drill 0.6)
  Top 0.305: v1.5,12.45 U7.5
  Top 1.27: USB.1 7.09,21.23 7.09,15.75 8.1,14.73 11.53,14.73 v12.3,13.97
  Bottom 0.508: 6.2,22.48 4.55,22.48 3.91,21.84 3.91,19.18 5.31,17.78 5.31,15.24 2.77,12.7 C73.1
  Bottom 1.016: v1.5,12.45 C73.1 | USB.1 7.11,21.57 6.2,22.48
  Bottom 1.27: v12.3,13.97 12.3,12.38 L1.1
N$27  (via drill 0.6)
  Top 0.508: C3.1 30.07,11.18
  Top 1.016: Q1.2 27.66,11.18 C3.1 v33,11.18
  Bottom 0.508: U1.8 31.85,9.35 33,10.49 v33,11.18
N$28  (via drill 0.6)
  Top 0.508: C2.1 31.34,6.1 32.11,6.86 32.11,8.13 v33.12,9.14
  Top 1.016: Q1.1 27.66,6.1 C2.1
  Bottom 0.508: v33.12,9.14 32.53,8.55 U1.7
N$29  (via drill 0.6)
  Top 0.508: R40.2 51.41,17.27 50.52,16.38 50.52,15.24 51.28,14.48 53.7,14.48 54.97,13.21 56.11,13.21 56.49,13.59 v58.02,13.59
  Bottom 0.508: 60.81,7.87 61.19,8.26 61.19,8.76 | 61.19,8.76 61.19,12.95 60.55,13.59 v58.02,13.59 | 61.19,8.76 60.55,8.13
  Bottom 1.27: TR1.1 59.92,6.99 60.81,7.87
N$30
  Bottom 0.508: 67.03,7.75 68.05,8.76 68.05,12.95 67.67,13.34 67.67,14.61 68.43,15.37 R41.2
  Bottom 1.27: TR2.1 66.65,7.37 67.03,7.75
N$35
  Top 0.356: U4.19 10.97,8.86 10.62,8.51 5.06,8.51
  Top 1.016: 5.06,8.51 2.64,6.1 R13.2 R12.1
N$78  (via drill 0.6)
  Top 0.356: U4.17 v10.01,10.16
  Bottom 1.016: C23.1 v10.01,10.16
N$79  (via drill 0.6)
  Top 0.356: 14.58,8.21 U4.20 | 15.6,4.45 17.58,4.45 18.1,4.96 U4.4
  Top 0.762: v14.58,7.24 15.6,6.22 15.6,4.45 15.6,1.27 15.09,0.76 3.91,0.76 R12.2
  Top 1.27: v14.58,7.24 14.58,8.21 14.58,13.97 v13.95,14.61
  Bottom 0.762: 14.58,13.53 14.58,13.51 FET.2
  Bottom 1.016: C18.1 14.33,6.1 14.2,6.1
  Bottom 1.27: v14.58,7.24 14.33,6.99 14.33,6.1 | L1.2 12.3,9.46 12.3,6.73 C19.+ 12.17,6.1 14.2,6.1 | v13.95,14.61 14.58,13.97 14.58,13.53
N$81
  Top 0.508: C55.2 56.62,23.88 57.13,24.38 64.24,24.38 64.62,24 R44.1
  Top 1.016: R42.1 C55.2
N$83
  Bottom 0.508: 22.84,39.88 22.84,40.01 C51.1 23.34,40.26 23.72,39.88 | 22.84,39.5 22.84,39.88 | 22.84,39.5 U5.11 | U5.12 24.11,39.5 | 24.11,39.5 23.72,39.88 | 23.72,39.88 22.84,39.88 | 24.11,39.5 22.84,39.5
N$84  (via drill 0.6)
  Top 1.016: v25.63,25.27 R23.1
  Bottom 0.508: v25.63,25.27 25.63,26.8 25.38,27.05 U5.4
N$88
  Bottom 0.508: U5.2 27.92,29.72 30.58,32.38
  Bottom 1.016: 30.58,32.38 R24.1
N$92  (via drill 0.6)
  Top 1.016: 23.85,30.1 R22.2 | 23.85,30.1 C37.1 R26.2 22.96,28.19 22.07,27.3 D2.3 | 23.85,30.1 v22.84,30.1 C40.1
  Bottom 0.254: R53.2 16.87,32.26 17.63,33.02 21.95,33.02 22.84,32.13 v22.84,30.1
N$93  (via drill 0.6)
  Top 1.016: 25.63,30.1 R21.2 | 25.63,30.1 C37.2 R23.2 26.39,28.19 27.28,27.3 27.66,27.3 | 25.63,30.1 C39.2 | 27.66,27.3 D1.3 | v27.66,25.27 27.66,27.3
  Bottom 0.508: R8.2 31.6,30.61 31.6,27.94 32.49,27.05 32.49,25.78 31.98,25.27 v27.66,25.27
N$94  (via drill 0.6)
  Top 1.016: 54.33,30.1 v53.32,30.1 C42.1 | 54.33,30.1 C38.1 R32.2 53.7,28.19 52.81,27.3 D4.3 | 54.33,30.1 R28.2
  Bottom 0.254: 46.84,32.13 47.73,33.02 52.3,33.02 53.32,32 v53.32,30.1
  Bottom 1.016: R55.2 46.84,32.13
N$95  (via drill 0.6)
  Top 0.508: D3.3 58.27,27.3
  Top 1.016: 56.11,30.1 R27.2 | 56.11,30.1 C38.2 R29.2 56.74,28.19 57.63,27.3 D3.3 58.78,27.3 v58.78,26.29 | 56.11,30.1 C41.2
  Bottom 0.508: R54.2 61.06,30.86 60.68,30.48 60.68,26.92 60.05,26.29 v58.78,26.29
N$101
  Bottom 0.508: U5.15 27.92,36.58 30.58,33.91
  Bottom 1.016: R25.1 30.58,33.91
N$102  (via drill 0.6)
  Top 0.508: v24.49,42.04 25.63,40.89 29.31,40.89 30.07,40.13 42.01,40.13 42.77,40.89 45.44,40.89 46.2,40.13 61.32,40.13 61.82,39.62 64.87,39.62 v65.64,40.39 | IC1.3 58.78,17.27 58.9,17.14 58.9,14.35 59.28,13.97 v68.68,13.97
  Bottom 0.508: v65.64,40.39 67.16,38.86 67.16,29.46 64.75,27.05 64.75,25.15 65.76,24.13 69.44,24.13 70.46,23.11 70.46,19.68 69.44,18.67 69.44,14.73 v68.68,13.97
  Bottom 1.016: R36.1 C51.2 v24.49,42.04
N$103
  Bottom 0.508: IC3.5 34.39,37.47 33.88,36.96 33.88,34.67 R25.2
  Bottom 1.016: R24.2 R25.2
N$104
  Top 0.508: C53.2 54.84,20.57 55.6,19.81 IC1.1
  Top 1.016: C55.1 C53.2 R38.2
N$105
  Top 0.508: 54.59,18.54 IC1.2
  Top 1.016: R38.1 C53.1 54.59,18.54 R40.1
N$106  (via drill 0.6)
  Top 1.016: v23.85,25.27 R26.1
  Bottom 0.508: v23.85,25.27 23.85,26.8 24.11,27.05 U5.5
N$107
  Top 0.254: C59.1 68.17,18.16 63.91,18.16 63.65,17.91 61.06,17.91 60.81,17.65
  Top 0.508: 60.81,17.65 60.81,16.38 61.19,16 IC1.5
  Top 1.016: C59.1 R46.2
N$108
  Top 1.016: R46.1 R44.2 C57.1
N$109  (via drill 0.6)
  Top 0.508: C61.2 64.36,18.8 63.6,18.8 63.35,18.54 IC1.7 60.3,18.54 59.92,18.16 v59.92,14.99
  Top 1.016: C57.2 C61.2 R50.2
  Bottom 0.508: v59.92,14.99 57.89,14.99 55.6,12.7 55.6,5.97 55.22,5.59 49.76,5.59 49.25,6.1 49.25,8.38 48.87,8.76 48.24,8.76 R10.2
N$110
  Top 0.508: IC1.6 C61.1
  Top 1.016: R50.1 C61.1 R48.1
N$113  (via drill 0.6)
  Top 0.508: v54.97,42.04 56.11,40.89 61.7,40.89 62.21,40.39 63.73,40.39 v64.62,41.27
  Bottom 0.254: 69.44,21.46 69.32,21.34 63.73,21.34 62.71,20.32 62.71,20.14
  Bottom 0.508: v64.62,41.27 64.62,39.5 66.4,37.72 66.4,29.84 63.98,27.43 63.98,24.64 65.25,23.37 69.06,23.37 69.44,22.99 69.44,21.46 | IC2.3 62.97,17.27 62.71,17.53 62.71,20.14
  Bottom 1.016: C52.2 R37.1 v54.97,42.04
N$125
  Bottom 0.508: IC2.1 66.65,19.81
  Bottom 1.016: C56.1 66.65,19.81 C54.2 R39.2
N$126
  Bottom 0.508: IC2.2 65.25,18.54 C54.1
  Bottom 1.016: R39.1 C54.1 R41.1
N$127
  Bottom 0.254: 60.17,17.91 60.43,17.65 | C60.1 53.06,17.91 60.17,17.91 | 60.55,17.65 60.55,17.78 60.43,17.91 60.17,17.91
  Bottom 0.508: IC2.5 60.05,16 60.43,16.38 60.43,17.65
  Bottom 1.016: C60.1 R47.2
N$128
  Bottom 1.016: R47.1 R45.2 C58.1
N$129
  Bottom 0.508: R9.2 50.01,3.05 51.66,4.7 61.19,4.7 61.95,5.46 61.95,17.91 61.32,18.54 IC2.7 56.87,18.54 C62.2
  Bottom 1.016: C58.2 C62.2 R51.2
N$130
  Bottom 0.508: C62.1 56.62,17.27 IC2.6
  Bottom 1.016: R51.1 C62.1 R49.1
N$131
  Bottom 0.254: 57.51,21.34 57.51,19.3 57.63,19.18 60.81,19.18 63.86,22.23 65,22.23
  Bottom 0.508: R45.1 56.87,21.97 57.51,21.34
  Bottom 1.016: R43.1 C56.2 65,22.23
N$133
  Bottom 0.508: 53.32,39.37 53.32,39.75 | 53.32,39.75 53.32,40.26 C52.1 53.7,40.26 54.2,39.75 | 53.32,39.37 U6.11 | U6.12 54.59,39.37 | 54.59,39.37 54.2,39.75 | 54.59,39.37 53.32,39.37 | 54.2,39.75 53.32,39.75
N$134
  Bottom 0.508: U6.2 58.4,29.72 61.06,32.38
  Bottom 1.016: 61.06,32.38 R30.1
N$135
  Bottom 0.508: U6.15 58.4,36.58 61.06,33.91
  Bottom 1.016: R31.1 61.06,33.91
N$136  (via drill 0.6)
  Top 0.508: v44.3,38.61 45.31,37.59 60.43,37.59 v60.94,37.08
  Bottom 0.508: IC3.3 44.17,38.73 v44.3,38.61 | v60.94,37.08 61.57,37.72 63.6,37.72 64.62,36.7 64.62,34.8 R31.2
  Bottom 1.016: R31.2 R30.2
N$137  (via drill 0.6)
  Top 1.016: v56.11,25.27 R29.1
  Bottom 0.508: v56.11,25.27 R29.1 55.86,26.67 U6.4
N$138  (via drill 0.6)
  Top 1.016: v54.33,25.27 R32.1
  Bottom 0.508: v54.33,25.27 R32.1 54.59,26.67 U6.5
N$139
  Bottom 0.508: 40.87,40.01 IC3.2 | R34.2 40.87,40.01 | IC3.1 41.12,41.27 40.87,41.02 40.87,40.01
N$140
  Bottom 0.508: IC3.7 38.84,40.01 39.09,39.75 39.09,38.73 | 39.09,38.73 IC3.6 | R33.2 39.09,38.73
N$141  (via drill 0.6, 1 pad 1.78)
  Top 0.508: 43.16,31.11 42.9,31.11 IC4.5
  Top 1.016: v44.81,28.07 44.81,30.48 44.17,31.11 43.16,31.11 | TR3.2 v52.68,9.53
  Bottom 0.508: v44.81,28.07 48.11,24.77 49.89,24.77 50.52,24.13 50.52,16.38 49.51,15.37 | TR3_DIS.1 50.52,8.26
  Bottom 1.016: 49.51,15.37 49.51,10.16 TR3.2 50.52,9.14 50.52,8.26
N$142  (via drill 0.6)
  Top 0.508: IC4.7 40.36,28.7 v40.87,28.19
  Bottom 1.016: R35.2 C44.1 v40.87,28.19
N$144
  Bottom 1.016: R20.1 R19.2
N$145  (via drill 0.6)
  Top 0.254: 58.14,12.45 59.03,13.34 67.67,13.34 68.3,12.7 68.17,12.7 68.17,11.3 67.67,10.79 58.65,10.79 58.27,11.18 58.27,12.45 58.14,12.45
  Top 0.508: v42.01,33.4 41.63,33.02 IC4.6 | v51.92,25.4 50.52,24 50.52,18.16 49.76,17.4 49.76,14.61 50.65,13.72 53.32,13.72 54.59,12.45 58.14,12.45 | 68.3,12.7 v69.19,12.7
  Bottom 0.508: 42.52,33.4 42.77,33.15 42.77,30.86 43.79,29.84 46.08,29.84 49.51,26.42 50.9,26.42 v51.92,25.4 | v69.19,12.7 70.21,13.72 70.21,17.78 70.59,17.78
  Bottom 1.016: R33.1 R34.1 40.87,33.4 | 40.87,33.4 v42.01,33.4 42.52,33.4 | 40.87,33.4 C43.1
  Bottom 1.27: 70.59,17.78 COM.P$1
N$146
  Bottom 0.762: R16.2 77.19,1.65 78.97,3.43 78.97,6.6 77.32,8.26 R17.2 75.29,8.64 R19.1
N$148
  Bottom 1.016: V_CAL.P$1 79.22,1.14 R16.1
N$149
  Bottom 1.016: GND_CAL.P$1 R18.1
N$168
  Bottom 1.016: FET.1 16.67,11.87 C17.2 R11.2
PD5  (via drill 0.6)
  Top 0.254: v39.73,11.56 39.73,10.54 40.11,10.16 40.11,9.27 39.47,8.64 39.47,7.87 40.87,6.48 | 50.39,4.95 50.52,4.83 50.7,4.83 | 50.7,4.83 62.59,4.83 62.71,4.95 | 50.7,4.83 50.57,4.95
  Top 0.508: 40.87,6.48 44.43,6.48 45.95,4.95 50.39,4.95 | 62.71,4.95 63.22,5.46 v64.24,5.46
  Bottom 0.508: R20.2 70.21,7.37 70.21,3.43 69.7,2.92 66.78,2.92 v64.24,5.46 | U1.14 34.02,12.43 34.39,12.06 39.22,12.06 v39.73,11.56
PE  (via drill 0.6)
  Top 0.508: 31.09,9.53 C3.2 31.85,10.16 33.63,10.16 34.27,10.79 v34.27,10.92 | 29.19,13.21 28.8,13.21
  Top 0.762: 26.52,8.51 26.52,16.26 | 26.52,8.51 26.52,1.27 28.3,1.27 v29.06,2.03 29.06,3.56 30.2,4.7 32.11,4.7 33,5.59 | 26.52,8.51 26.65,8.51 | C72.2 35.79,5.59 v35.03,5.59 33,5.59 | 33,5.59 33,7.11 35.28,9.4 C1.2
  Top 1.016: 31.09,8.51 C2.2 | 31.09,8.51 C3.2 | 26.65,8.51 31.09,8.51 | v72.75,8 73.64,8.89 77.45,8.89 | v81.51,44.07 R62.1 | C1.2 C8.2 v34.27,10.92 34.27,11.94 33.76,12.45 32.74,12.45 | 32.74,12.45 29.95,12.45 29.19,13.21 | 32.74,12.45 C7.2
  Top 1.27: U2.5 24.23,16.89 24.87,16.26 26.52,16.26 28.8,16.26 29.19,15.88 29.19,13.21 | 77.45,8.89 ICSP.10 ICSP.8 ICSP.6 ICSP.4
  Bottom 0.508: U1.6 33.17,7.75 34.27,8.84 v34.27,10.92 | U1.39 36.42,4.19 v35.03,5.59 | U1.18 37.23,16.98 37.19,17.02 | 69.83,0.76 69.7,0.64 31.47,0.64 30.07,2.03 v29.06,2.03 28.55,2.54 28.55,3.68 28.17,4.06 27.79,4.06 C13.2 | 26.65,7.49 26.65,8.33
  Bottom 0.61: 27.03,8.33 27.03,7.87 26.65,7.49 26.01,6.86 U3.5
  Bottom 0.762: 27.03,15.11 C12.2 | 69.83,0.76 71.1,2.03 71.1,6.35 v72.75,8 | 81.51,20.57 81.64,20.7 81.64,43.94 v81.51,44.07
  Bottom 1.016: 26.52,15.11 27.03,15.11 | 36.55,19.94 C25.2 | 31.34,20.07 C24.2 | ICSP.4 81.51,20.57
  Bottom 1.27: 26.52,15.11 25.76,15.88 25.76,17.53 C11.- 24.74,17.53 24.23,18.03 U2.5 26.14,22.61 31.34,22.61 | 27.03,15.11 27.03,8.33 | 36.55,21.84 36.55,20.83 | 36.55,20.83 36.55,19.94 | 36.55,17.02 C26.- | 36.55,19.94 36.55,18.03 | 36.55,18.03 36.55,17.02 | 31.34,22.61 31.34,20.07 | 31.34,22.61 35.03,22.61 35.79,21.84 36.55,21.84 | 36.55,19.94 R52.2 | 39.47,19.94 38.46,19.94 37.19,18.67 | 39.47,19.94 39.73,20.19 39.73,18.92 41,18.92 41.38,19.3 41.38,20.83 | 36.55,21.84 41.38,21.84 41.38,20.83 | 36.55,18.03 37.19,18.67 | 36.55,17.02 37.19,17.02 37.19,18.67 | 37.19,18.67 38.71,18.67 39.47,19.43 39.47,19.94 | 36.55,20.83 41.38,20.83
  pour Bottom (isolate 0.508): 23.47,23.5 23.47,-6.99 39.35,-6.99 39.35,3.17 43.16,3.17 43.16,23.5
  pour Top (isolate 0.508): 23.47,22.86 23.47,-8.26 39.35,-8.26 39.35,3.17 43.16,3.17 43.16,19.05 31.73,19.05 31.73,22.86
PWREN  (via drill 0.6)
  Top 0.356: U4.14 16.77,11.46 16.23,10.92 v16.23,8.76
  Bottom 1.016: v16.23,8.76 15.09,8.76 14.71,9.14 R11.1
RST  (via drill 0.6)
  Top 0.254: 38.2,7.62 38.96,6.86 38.96,4.32 39.09,4.19
  Top 0.508: R1.2 38.2,7.62 | 39.09,4.19 39.6,3.68 67.29,3.68 v67.54,3.94
  Top 0.762: C1.1 35.79,7.62 v35.03,6.86
  Top 1.016: C1.1 R1.2
  Bottom 0.508: 75.44,15.88 75.41,15.88 73.13,13.59 71.73,13.59 70.21,12.06 RST.P$1 70.21,10.29 70.08,10.16 70.08,9.53 68.43,7.87 68.43,4.83 v67.54,3.94 | U1.4 34.06,6.15 34.77,6.86 v35.03,6.86
  Bottom 1.27: 75.44,15.88 ICSP.5
SCK  (via drill 0.6)
  Top 0.508: v69.19,3.94 68.17,2.92 35.92,2.92 v35.28,3.56
  Bottom 0.508: v69.19,3.94 69.19,7.49 71.22,9.53 71.22,11.94 72.11,12.83 74.14,12.83 74.65,13.34 74.68,13.34 | U1.3 33.49,5.35 v35.28,3.56
  Bottom 1.27: 74.68,13.34 ICSP.7
USBDM  (via drill 0.6)
  Top 0.356: U4.16 10.88,10.81 v10.01,11.68
  Top 1.016: R14.2 v10.01,11.68
  Bottom 1.016: v10.01,11.68 R14.2
USBDP  (via drill 0.6)
  Top 0.356: U4.15 11.25,11.46 11.03,11.68 11.03,12.19 v10.01,13.21
  Top 1.016: R15.2 v10.01,13.21
  Bottom 1.016: v10.01,13.21 R15.2
VCC/2  (via drill 0.6, 1 pad 1.78)
  Top 0.508: 38.84,28.19 39.09,27.94 IC4.1 39.09,24.51 39.09,23.62 | 40.36,23.62 40.36,24.51 IC4.2 | 40.36,23.11 C32.+
  Top 1.016: v20.17,39.88 v28.8,39.88 29.57,39.12 v35.28,39.12 39.73,39.12 | 39.73,39.12 42.52,39.12 43.28,39.88 44.93,39.88 45.7,39.12 v49.38,39.12 v60.81,39.12 61.32,38.61 65.38,38.61 65.76,38.99 v70.84,38.99 | 38.71,28.19 38.84,28.19 | 38.08,28.19 38.71,28.19 | 38.08,28.19 C30.1 36.93,27.69 38.08,26.54 | 40.36,23.11 40.36,23.62 39.09,23.62 38.84,23.62 | 38.71,23.62 38.84,23.62 | 38.71,23.62 C31.1 38.2,23.75 | 38.84,23.62 39.85,22.61 40.36,22.61 | 39.09,24.51 40.36,24.51 41.25,24.51 41.76,24 | v38.2,26.42 38.08,26.42 38.08,26.54 | 38.08,26.54 38.08,28.19 | 38.71,23.62 38.71,28.19 | v37.19,33.4 38.96,33.4 39.73,34.16 39.73,39.12 | v58.02,23.37 C67.2 | v51.54,22.1 R42.2 | v51.54,15.75 C65.2 | R48.2 67.92,15.75 C59.2 69.95,16 | VREF.P$1 69.95,20.32 | 69.95,20.32 69.95,16 | 69.95,20.32 v69.44,20.32 | 69.95,16 69.95,13.97 70.46,13.46 70.46,12.06 67.92,9.53 v66.65,9.53
  Top 1.27: v38.2,26.42 38.2,23.75 | TR3.1 55.22,9.53 TR1.2 v59.67,9.53 TR2.2 v66.65,9.53 | TR2.3 TR1.3
  Bottom 0.254: 50.9,11.3 51.41,10.79 51.41,6.99
  Bottom 0.356: 75.54,17.14 80.49,17.14
  Bottom 0.508: U5.10 21.57,39.62 21.31,39.88 | R37.2 52.05,40.26 U6.10 | 75.29,17.4 75.54,17.14 | 50.52,6.99 TR3_DIS.2 | R54.1 65.13,30.86 65.64,31.37 65.64,37.08 64.11,38.61 61.32,38.61 v60.81,39.12
  Bottom 1.016: R17.1 R18.2 81.13,9.14 81.13,16.51 80.49,17.14 | R36.2 21.31,39.88 v20.17,39.88 19.53,39.88 18.9,39.24 18.9,35.18 18.39,34.67 C47.2 R53.1 | v28.8,39.88 27.54,39.88 C46.2 | v60.81,39.12 59.67,40.26 C49.2 | R37.2 51.79,39.88 49.76,39.88 49.38,39.5 v49.38,39.12 49.38,35.05 48.87,34.54 C50.2 R55.1 C71.2 | C69.2 35.28,42.16 v35.28,39.12 | v38.2,26.42 37.19,27.43 37.19,30.86 | v37.19,33.4 37.19,30.86 | C67.2 v58.02,23.37 57.89,23.24 51.92,23.24 51.54,22.86 v51.54,22.1 v51.54,15.75 | v51.54,15.75 C60.2 53.06,15.49 R49.2 | 65.89,13.21 65.76,13.21 C68.2 | v69.44,20.32 68.56,20.32 R43.2 | VREF.P$1 72.37,20.32 75.29,17.4 | 50.9,11.3 50.9,15.11 v51.54,15.75 | v70.84,38.99 70.84,24.51 71.86,23.5 | 50.52,6.99 51.41,6.99 TR3.1 | 37.19,30.86 R8.1
  Bottom 1.27: 65.89,12.06 65.89,13.21 66.65,12.45 TR2.3 | TR2.3 65.89,11.3 | 65.89,9.53 65.89,11.3 | 65.89,9.53 v66.65,9.53 TR2.3 | 65.89,9.53 TR2.2 | 71.86,23.5 VREF.P$1 | TR2.3 65.89,12.06 | 65.89,11.3 65.89,12.06
VPP  (via drill 0.6)
  Top 0.508: v29.69,0.89 29.95,0.64 30.33,0.64 | 30.71,0.64 30.33,0.64 | 30.71,0.64 76.18,0.64 76.3,0.76 | v29.69,0.89 30.07,0.89 | 30.07,0.89 30.07,1.27 | 30.07,1.27 30.07,3.17 30.71,3.81 32.49,3.81 33.25,4.57 37.57,4.57 v38.08,5.08 | 30.07,0.89 30.33,0.64 | 30.07,1.27 30.71,0.64 | v29.69,0.89 30.07,1.27
  Top 0.762: 78.97,7.37 78.97,3.43 76.3,0.76 | C8.1 38.08,12.32 37.06,13.34 35.71,13.34 34.39,14.66 34.39,15.37 v34.27,15.37
  Top 1.016: C8.1 R1.1 38.08,9.78 v39.22,9.78 | v38.08,5.08 C72.1 | v34.27,15.37 C7.1
  Top 1.27: ICSP.2 81.38,18.92 81.38,9.78 78.97,7.37 | 33.12,19.81 v33.12,21.08 v34.39,21.08 33.12,19.81 | 33.12,19.81 L3.1
  Bottom 0.508: 36.42,9.78 33.59,6.95 U1.5 | v38.08,5.08 37.23,4.23 U1.38 | U1.17 36.42,14.73 36.04,15.11 34.52,15.11 v34.27,15.37
  Bottom 0.762: U3.8 26.52,3.05 27.03,2.54 C13.1 27.54,1.27 27.92,0.89 v29.69,0.89
  Bottom 1.016: C24.1 34.39,19.94 | 34.39,19.94 34.39,20.07 | 34.39,19.94 C25.1 | v38.08,5.08 38.08,9.78 | v34.27,15.37 33.38,16.26 33.38,17.02 | 38.08,9.78 v39.22,9.78 | 38.08,9.78 36.42,9.78
  Bottom 1.27: C26.+ 33.38,17.02 33.12,17.02 33.12,18.03 | 33.12,18.03 L2.2 | 33.12,18.03 C24.1 v33.12,21.08 v34.39,21.08 34.39,20.07

## Text on the board
tNames: + | 1 | + | + | + | 9 | 10 | Rev.B | MOD-EEG-SMT WWW.OLIMEX.COM (C) 2011
bNames: + | + | + | +